# Altium schematic sheet 5V LD1117S50CTR.SchDoc
size A4; Author: Wojciech Grędel; CompanyName: AGH Racing; Revision: 4; SheetNumber: 1; SheetTotal: 1; CarNumber: 6; ProjectName: Project Name
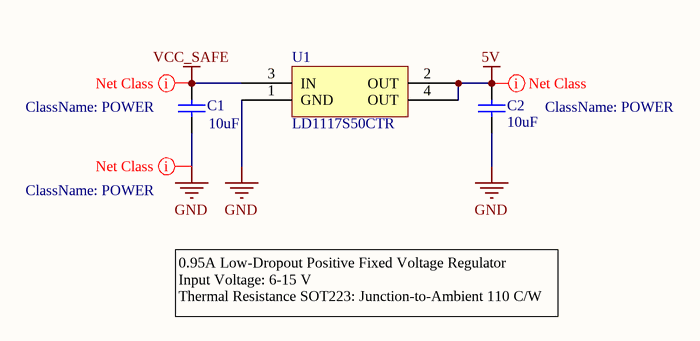
[diagram p0: 5V LD1117S50CTR.SchDoc]

## Parts
C1  value 10uF  [CAP_0603_IPC_MD]  (hidden comment: Cap)
C2  value 10uF  [CAP_0603_IPC_MD]  (hidden comment: Cap)
U1  LD1117S50CTR  [SOT223_IPC_MD]

## Nets
5V: C2.2 U1.2(OUT) U1.4(OUT)
GND: C1.1 C2.1 U1.1(GND)
VCC_SAFE: C1.2 U1.3(IN)

## Layout directives
net class POWER: 5V, GND, VCC_SAFE

## Notes on the sheet
- 0.95A Low-Dropout Positive Fixed Voltage Regulator
  Input Voltage: 6-15 V
  Thermal Resistance SOT223: Junction-to-Ambient 110 C/W
- Confidential / Not for distribution !
- Document name:
- Designer Name:
- Date/Time:
- Revision:

## Library data of the parts
C1 C2 = Cap: Capacitor
U1 = LD1117S50CTR: Manufacturer: ST Microelectronics; Part Number: LD1117S50CTR; Supplier: TME; Supplier Part Number: LD1117S50C; Type: IC; Mounting Technology: SMD; Manufacturer Part Number: LD1117S50CTR